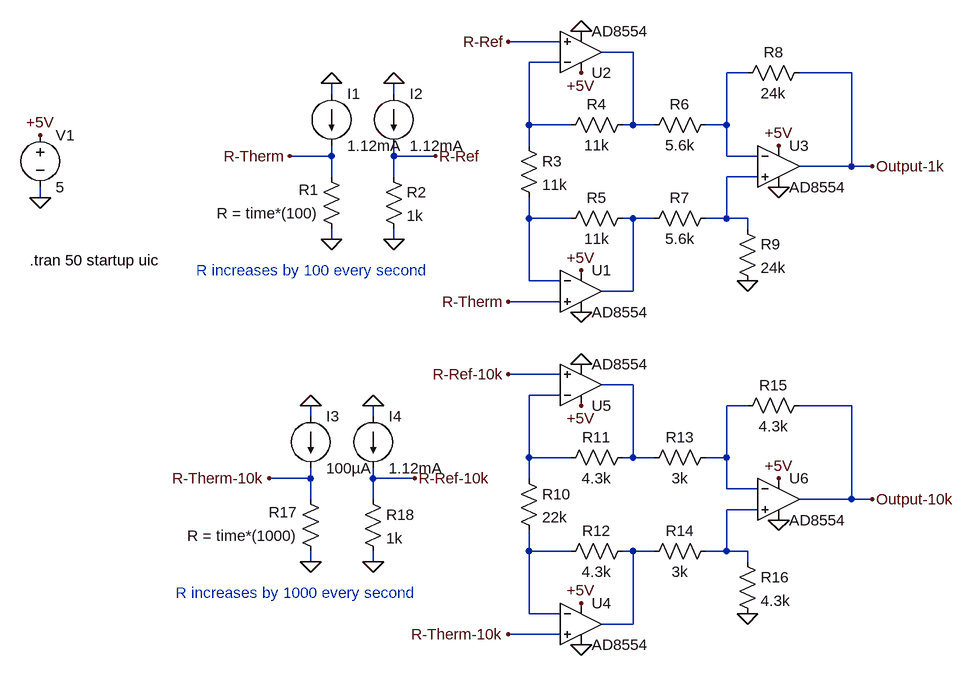
[diagram p0: schematic alternate circuit with 1mA current source.asc]
alternate circuit with 1mA current source.asc, the LTspice schematic file:
Version 4
SHEET 1 1384 844
WIRE 752 -128 672 -128
WIRE 864 -112 816 -112
WIRE 752 -96 704 -96
WIRE 1040 -80 1008 -80
WIRE 1200 -80 1120 -80
WIRE 400 -48 400 -64
WIRE 496 -48 496 -64
WIRE 704 0 704 -96
WIRE 768 0 704 0
WIRE 864 0 864 -112
WIRE 864 0 848 0
WIRE 896 0 864 0
WIRE 1008 0 1008 -80
WIRE 1008 0 976 0
WIRE 704 32 704 0
WIRE 400 48 400 32
WIRE 400 48 336 48
WIRE 496 48 496 32
WIRE 560 48 496 48
WIRE 1008 48 1008 0
WIRE 1056 48 1008 48
WIRE 1200 64 1200 -80
WIRE 1200 64 1120 64
WIRE 1232 64 1200 64
WIRE 400 80 400 48
WIRE 496 80 496 48
WIRE 1056 80 1008 80
WIRE -48 112 -48 96
WIRE 704 144 704 112
WIRE 768 144 704 144
WIRE 864 144 848 144
WIRE 896 144 864 144
WIRE 1008 144 1008 80
WIRE 1008 144 976 144
WIRE 1040 144 1008 144
WIRE 1040 160 1040 144
WIRE 400 176 400 160
WIRE 496 176 496 160
WIRE 704 240 704 144
WIRE 752 240 704 240
WIRE 864 256 864 144
WIRE 864 256 816 256
WIRE 752 272 672 272
WIRE 752 384 672 384
WIRE 864 400 816 400
WIRE 752 416 704 416
WIRE 1040 432 1008 432
WIRE 1200 432 1120 432
WIRE 368 448 368 432
WIRE 464 448 464 432
WIRE 704 512 704 416
WIRE 768 512 704 512
WIRE 864 512 864 400
WIRE 864 512 848 512
WIRE 896 512 864 512
WIRE 1008 512 1008 432
WIRE 1008 512 976 512
WIRE 368 544 368 528
WIRE 368 544 304 544
WIRE 464 544 464 528
WIRE 528 544 464 544
WIRE 704 544 704 512
WIRE 1008 560 1008 512
WIRE 1056 560 1008 560
WIRE 368 576 368 544
WIRE 464 576 464 544
WIRE 1200 576 1200 432
WIRE 1200 576 1120 576
WIRE 1232 576 1200 576
WIRE 1056 592 1008 592
WIRE 704 656 704 624
WIRE 768 656 704 656
WIRE 864 656 848 656
WIRE 896 656 864 656
WIRE 1008 656 1008 592
WIRE 1008 656 976 656
WIRE 1040 656 1008 656
WIRE 368 672 368 656
WIRE 464 672 464 656
WIRE 1040 672 1040 656
WIRE 704 752 704 656
WIRE 752 752 704 752
WIRE 864 768 864 656
WIRE 864 768 816 768
WIRE 752 784 672 784
FLAG 400 -64 0
FLAG 496 -64 0
FLAG 496 176 0
FLAG 400 176 0
FLAG 336 48 R-Therm
FLAG 560 48 R-Ref
FLAG -48 112 0
FLAG -48 16 +5V
FLAG 784 288 0
FLAG 784 -144 0
FLAG 1088 96 0
FLAG 784 224 +5V
FLAG 784 -80 +5V
FLAG 1088 32 +5V
FLAG 1232 64 Output-1k
FLAG 1040 240 0
FLAG 672 272 R-Therm
FLAG 672 -128 R-Ref
FLAG 784 800 0
FLAG 784 368 0
FLAG 1088 608 0
FLAG 784 736 +5V
FLAG 784 432 +5V
FLAG 1088 544 +5V
FLAG 1232 576 Output-10k
FLAG 1040 752 0
FLAG 672 784 R-Therm-10k
FLAG 672 384 R-Ref-10k
FLAG 368 432 0
FLAG 464 432 0
FLAG 464 672 0
FLAG 368 672 0
FLAG 304 544 R-Therm-10k
FLAG 528 544 R-Ref-10k
SYMBOL current 400 -48 R0
WINDOW 123 0 0 Left 0
WINDOW 39 0 0 Left 0
SYMATTR InstName I1
SYMATTR Value 1.12mA
SYMBOL current 496 -48 R0
WINDOW 123 0 0 Left 0
WINDOW 39 0 0 Left 0
SYMATTR InstName I2
SYMATTR Value 1.12mA
SYMBOL res 416 176 R180
WINDOW 0 36 76 Left 2
WINDOW 3 36 40 Left 2
SYMATTR InstName R1
SYMATTR Value R = time*(100)
SYMBOL res 480 64 R0
SYMATTR InstName R2
SYMATTR Value 1k
SYMBOL voltage -48 0 R0
WINDOW 123 0 0 Left 0
WINDOW 39 0 0 Left 0
SYMATTR InstName V1
SYMATTR Value 5
SYMBOL res 688 16 R0
SYMATTR InstName R3
SYMATTR Value 11k
SYMBOL res 864 -16 R90
WINDOW 0 0 56 VBottom 2
WINDOW 3 32 56 VTop 2
SYMATTR InstName R4
SYMATTR Value 11k
SYMBOL res 752 160 R270
WINDOW 0 32 56 VTop 2
WINDOW 3 0 56 VBottom 2
SYMATTR InstName R5
SYMATTR Value 11k
SYMBOL res 992 -16 R90
WINDOW 0 0 56 VBottom 2
WINDOW 3 32 56 VTop 2
SYMATTR InstName R6
SYMATTR Value 5.6k
SYMBOL res 880 160 R270
WINDOW 0 32 56 VTop 2
WINDOW 3 0 56 VBottom 2
SYMATTR InstName R7
SYMATTR Value 5.6k
SYMBOL res 1136 -96 R90
WINDOW 0 0 56 VBottom 2
WINDOW 3 32 56 VTop 2
SYMATTR InstName R8
SYMATTR Value 24k
SYMBOL res 1024 144 R0
SYMATTR InstName R9
SYMATTR Value 24k
SYMBOL OpAmps\\AD8554 784 192 R0
SYMATTR InstName U1
SYMBOL OpAmps\\AD8554 784 -48 M180
SYMATTR InstName U2
SYMBOL OpAmps\\AD8554 1088 0 R0
SYMATTR InstName U3
SYMBOL res 688 528 R0
SYMATTR InstName R10
SYMATTR Value 22k
SYMBOL res 864 496 R90
WINDOW 0 0 56 VBottom 2
WINDOW 3 32 56 VTop 2
SYMATTR InstName R11
SYMATTR Value 4.3k
SYMBOL res 752 672 R270
WINDOW 0 32 56 VTop 2
WINDOW 3 0 56 VBottom 2
SYMATTR InstName R12
SYMATTR Value 4.3k
SYMBOL res 992 496 R90
WINDOW 0 0 56 VBottom 2
WINDOW 3 32 56 VTop 2
SYMATTR InstName R13
SYMATTR Value 3k
SYMBOL res 880 672 R270
WINDOW 0 32 56 VTop 2
WINDOW 3 0 56 VBottom 2
SYMATTR InstName R14
SYMATTR Value 3k
SYMBOL res 1136 416 R90
WINDOW 0 0 56 VBottom 2
WINDOW 3 32 56 VTop 2
SYMATTR InstName R15
SYMATTR Value 4.3k
SYMBOL res 1024 656 R0
SYMATTR InstName R16
SYMATTR Value 4.3k
SYMBOL OpAmps\\AD8554 784 704 R0
SYMATTR InstName U4
SYMBOL OpAmps\\AD8554 784 464 M180
SYMATTR InstName U5
SYMBOL OpAmps\\AD8554 1088 512 R0
SYMATTR InstName U6
SYMBOL current 368 448 R0
WINDOW 123 0 0 Left 0
WINDOW 39 0 0 Left 0
SYMATTR InstName I3
SYMATTR Value 100µA
SYMBOL current 464 448 R0
WINDOW 123 0 0 Left 0
WINDOW 39 0 0 Left 0
SYMATTR InstName I4
SYMATTR Value 1.12mA
SYMBOL res 384 672 R180
WINDOW 0 36 76 Left 2
WINDOW 3 36 40 Left 2
SYMATTR InstName R17
SYMATTR Value R = time*(1000)
SYMBOL res 448 560 R0
SYMATTR InstName R18
SYMATTR Value 1k
TEXT -64 208 Left 2 !.tran 50 startup uic
TEXT 192 224 Left 2 ;R increases by 100 every second
TEXT 160 720 Left 2 ;R increases by 1000 every second

The netlist it stands for:
* alternate circuit with 1mA current source.asc
I1 0 R-Therm 1.12mA
I2 0 R-Ref 1.12mA
R1 0 R-Therm R = time*(100)
R2 R-Ref 0 1k
V1 +5V 0 5
R3 N002 N005 11k
R4 N001 N002 11k
R5 N005 N006 11k
R6 N003 N001 5.6k
R7 N006 N004 5.6k
R8 Output-1k N003 24k
R9 N004 0 24k
XU1 R-Therm N005 +5V 0 N006 AD8554  ; pins In+ In- V+ V- OUT
XU2 R-Ref N002 +5V 0 N001 AD8554  ; pins In+ In- V+ V- OUT
XU3 N004 N003 +5V 0 Output-1k AD8554  ; pins In+ In- V+ V- OUT
R10 N008 N011 22k
R11 N007 N008 4.3k
R12 N011 N012 4.3k
R13 N009 N007 3k
R14 N012 N010 3k
R15 Output-10k N009 4.3k
R16 N010 0 4.3k
XU4 R-Therm-10k N011 +5V 0 N012 AD8554  ; pins In+ In- V+ V- OUT
XU5 R-Ref-10k N008 +5V 0 N007 AD8554  ; pins In+ In- V+ V- OUT
XU6 N010 N009 +5V 0 Output-10k AD8554  ; pins In+ In- V+ V- OUT
I3 0 R-Therm-10k 100µA
I4 0 R-Ref-10k 1.12mA
R17 0 R-Therm-10k R = time*(1000)
R18 R-Ref-10k 0 1k
.tran 50 startup uic
* R increases by 100 every second
* R increases by 1000 every second
.backanno
.end

* Results of the author's LTspice run, read from the files saved beside the schematic
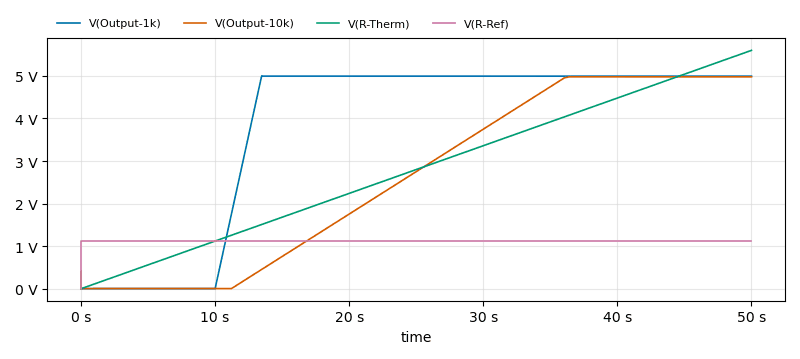
[diagram p1: Transient Analysis of alternate circuit with 1mA current source.asc, plotted from the saved traces]
* Transient Analysis, 1 run:
*   V(Output-1k): min 0 V, max 5.004 V, average 3.822 V, rms 4.337 V, last 4.994 V
*   V(Output-10k): min 0 V, max 4.981 V, average 2.621 V, rms 3.316 V, last 4.978 V
*   V(R-Therm): min 0 V, max 5.6 V, average 2.8 V, rms 3.236 V, last 5.6 V
*   V(R-Ref): min -1.42 mV, max 1.12 V, average 1.12 V, rms 1.12 V, last 1.12 V